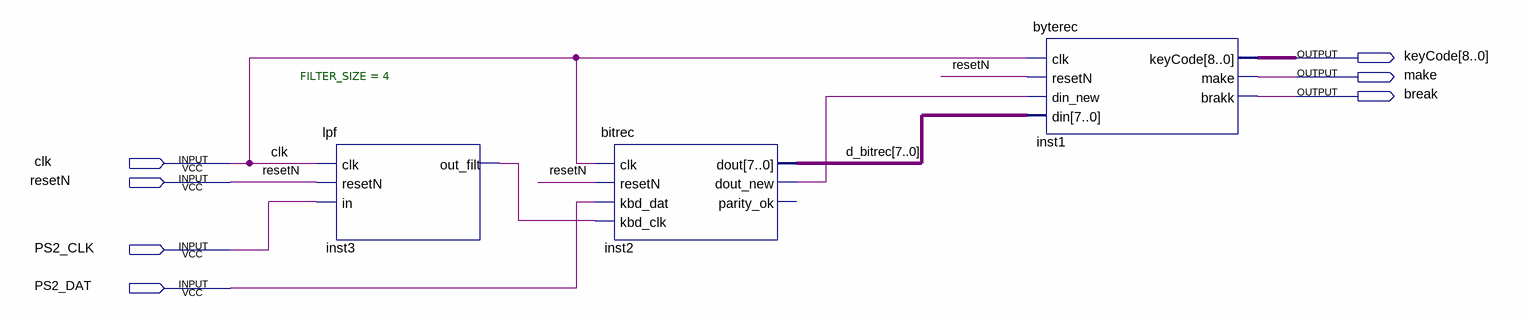
[diagram p0: schematic sheet]
// Quartus schematic KBDINTF.bdf as structural Verilog: 3 symbols, 7 pins
module KBDINTF (
  input  clk,
  input  resetN,
  input  PS2_CLK,
  input  PS2_DAT,
  output [8:0] keyCode,
  output make,
  output \break 
);

  wire inst2_dout_new, inst3_out_filt;
  wire [7:0] d_bitrec;

  lpf #(.FILTER_SIZE(4)) inst3 (.clk(clk), .resetN(resetN), .in(PS2_CLK), .out_filt(inst3_out_filt));
  bitrec inst2 (
    .clk(clk), .resetN(resetN), .kbd_dat(PS2_DAT), .kbd_clk(inst3_out_filt), .dout(d_bitrec),
    .dout_new(inst2_dout_new));  // open: parity_ok
  byterec inst1 (
    .clk(clk), .resetN(resetN), .din_new(inst2_dout_new), .din(d_bitrec), .keyCode(keyCode), .make(make),
    .brakk(\break ));
endmodule
